# Altium schematic sheet Transmitter.SchDoc
size A4; SheetNumber: 1; SheetTotal: 2
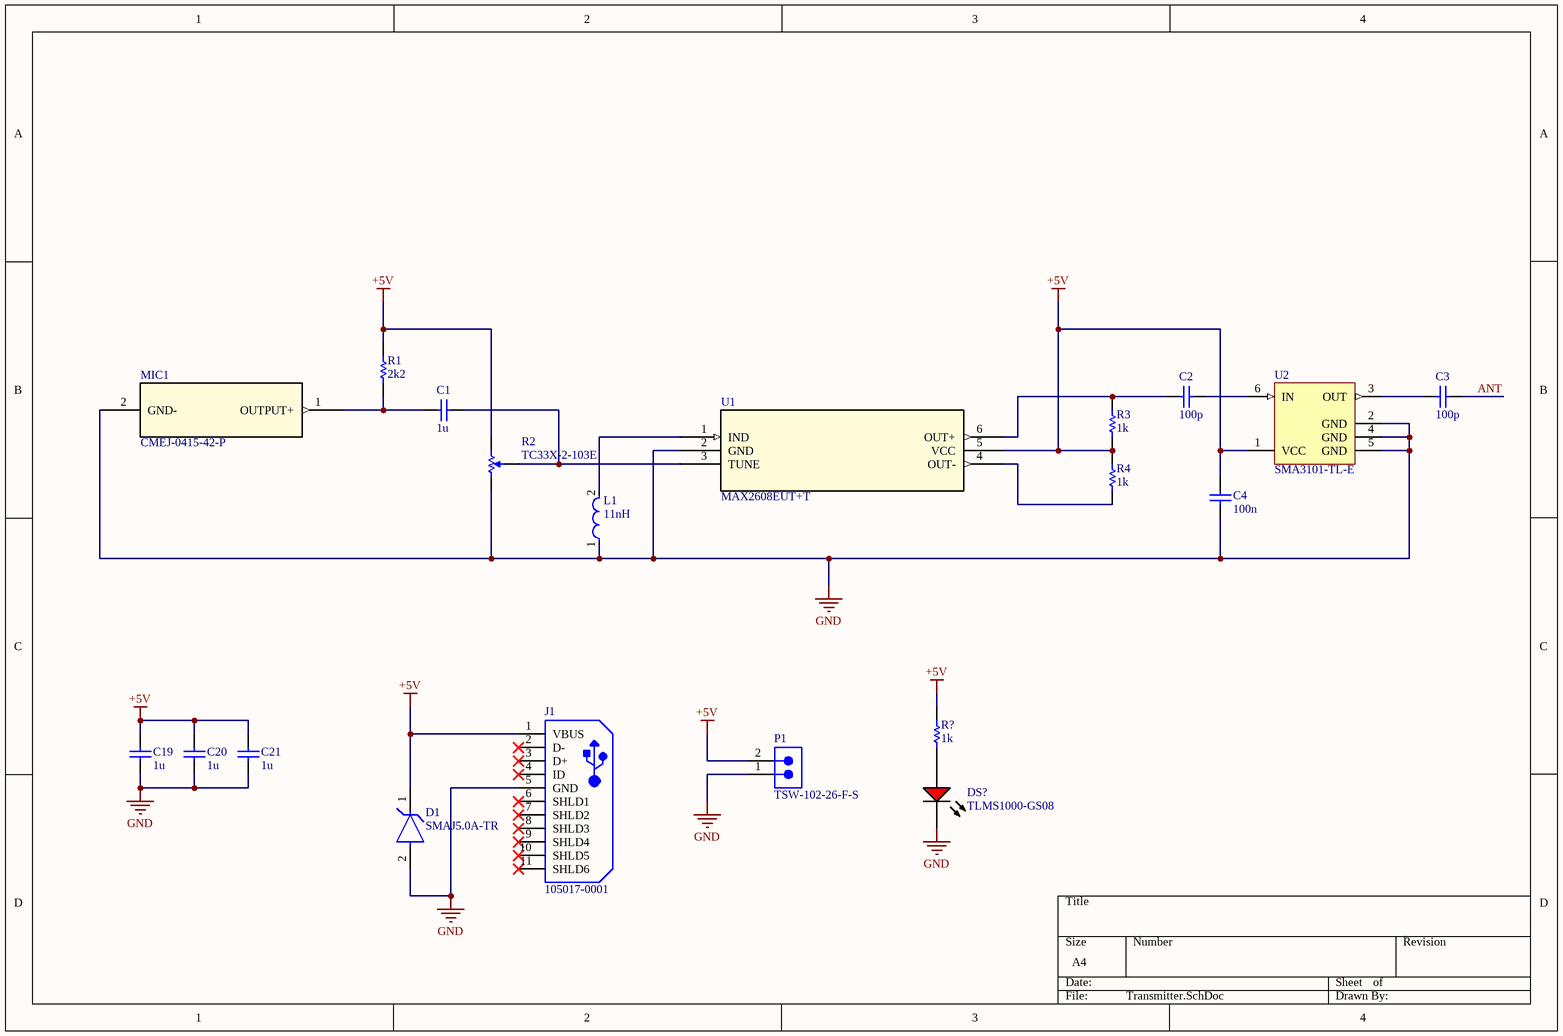
[diagram p0: Transmitter.SchDoc]

## Parts
C1  1u  [CAPC1608X90X35ML10T15]
C2  100p  [CAPC1608X90X35ML10T15]
C3  100p  [CAPC1608X90X35ML10T15]
C4  100n  [CAPC1608X90X35ML10T15]
C19  1u  [CAPC1608X90X35ML10T15]
C20  1u  [CAPC1608X90X35ML10T15]
C21  1u  [CAPC1608X90X35ML10T15]
D1  SMAJ5.0A-TR  [FP-SMA-MFG]
DS?  TLMS1000-GS08  [VISH-TLMS1000_V]
J1  105017-0001  [USB-MICRO-B_V]
L1  11nH  [FP-SRN2512-MFG]
MIC1  CMEJ-0415-42-P  [CMEJ-0415_CUD]
P1  TSW-102-26-F-S  [SMTC-TSW-102-26-XX-S]
R1  2k2  [RESC1608X55X25ML10T15]
R2  TC33X-2-103E  [BOUR-TC33X-2_V]
R3  1k  [RESC1608X55X25ML10T15]
R4  1k  [RESC1608X55X25ML10T15]
R?  1k  [RESC1608X55X25ML10T15]
U1  MAX2608EUT+T  [21-0058I_MXM]
U2  SMA3101-TL-E  [ONSC-MCPH-6_V]

## Nets
+5V: C4.2 C19.2 C20.2 C21.2 D1.1(K) J1.1(VBUS) P1.2 R1.2 R2.3 R3.1 R4.2 R?.1 U1.5(VCC) U2.1(VCC)
GND: C4.1 C19.1 C20.1 C21.1 D1.2(A) DS?.2(K) J1.5(GND) L1.1 MIC1.2(GND-) P1.1 R2.1 U1.2(GND) U2.2(GND) U2.4(GND) U2.5(GND)
ANT: C3.2
NetC1_1: C1.1 MIC1.1(OUTPUT+) R1.1
NetC1_2: C1.2 R2.2 U1.3(TUNE)
NetC2_1: C2.1 R3.2 U1.6(OUT+)
NetC2_2: C2.2 U2.6(IN)
NetC3_1: C3.1 U2.3(OUT)
NetDS?_1: DS?.1(A) R?.2
NetL1_2: L1.2 U1.1(IND)
NetR4_1: R4.1 U1.4(OUT-)

Not connected (* = marked no-connect by the designer): J1 2(D-)* 3(D+)* 4(ID)* 6(SHLD1)* 7(SHLD2)* 8(SHLD3)* 9(SHLD4)* 10(SHLD5)* 11(SHLD6)*

## Library data of the parts
C1-C4 C19-C21 = CMP-2100-03643-1: Chip Capacitor, 0.1 uF, +/- 10%, 50 V, -55 to 125 degC, 0603 (1608 Metric), RoHS, Tape and Reel; Manufacturer: Murata; Dielectric Material: Ceramic; Voltage Rating: 50V; Capacitance: 100nF; Dielectric: X7R; Insulation Resistance: 10GR; Case Code (Metric): 1608; Lead Free: LeadFree; Depth: 0.8mm; Number of Pins: 2; Radiation Hardening: No; Case/Package: 0603; Manufacturer URL: http://www.murata.com/; Packaging: TapeandReel; Length: 1.6mm; Contact Plating: Tin; Datasheet URL: http://psearch.en.murata.com/capacitor/product/GRM188R71H104KA93%23.pdf; Tolerance: 10%; Case Code (Imperial): 0603; Min Operating Temperature: -55degC; RoHSCompliant: true; Voltage: 50V; Termination: SMD/SMT; Mount: SurfaceMount; Material: Ceramic; Package Quantity: 1; Height: 0.8mm; Thickness: 0.035inch; REACH SVHC: NoSVHC; Max Operating Temperature: 125degC; Width: 0.8mm; Package Reference: 0603; Voltage Rating (DC): 50V; Datasheet Version: 42675.0; Package Description: 2-Pin Surface Mount Device, Body 1.6 x 0.8 mm
D1 = CMP-12225-000048-1: TVS DIODE 5V 13.4V SMA; Manufacturer: STMicroelectronics; Standoff Height: 0.05mm; Max Junction Temp: +150°C; Clamping Voltage: 9.2V; Number Of Channels: 1; Peak Pulse Power: 400W; Peak Pulse Current: 43.5A; Breakdown Voltage: 6.4V; Direction: Unidirectional; ComponentLink2Description: Datasheet; Lead Free: Yes; Package: SMA; Height: 2.65mm; Mouser Description: Transient Voltage Suppressor, TVS, Transil SMAJ Series, Unidirectional, 5 V, DO-214AC, 2, 6.4 V; Manufacturer Part Number: SMAJ5.0A-TR; Reverse Standoff Voltage: 5V; Temperature Range Low: -55°C; Device Class L1: Circuit Protection; RoHS: TRUE; Category: Diode; Automotive: No; ComponentLink2URL: https://www.st.com/resource/en/datasheet/smaj.pdf; Device Class L3: unset; Device Class L2: TVS Diodes; Temperature Range High: +150°C; Octopart: https://octopart.com/smaj5.0a-tr-stmicroelectronics-347063; Digikey Description: TVS DIODE 5V 13.4V SMA; Temperature: -55°C to +150°C
DS? = CMP-2000-07254-1: Low Current LED, 40 mW, 1.8 V, -40 to 100 degC, 2-Pin SMD (0603), RoHS, Tape and Reel; Manufacturer: Vishay; Lens Shape: Rectangular; Automotive Qualification Standard: AEC-Q100; Wavelength Typ: 636nm; SVHC: ToBeAdvised; LED Colour: Red; Bulb Size: 1.6mmx0.8mm; Forward Voltage: 1.8V; Luminous Intensity: 4mcd; Forward Current If: 2mA; Viewing Angle: 80°; Datasheet Version: Rev. 1.7, 02/2011; Datasheet URL: https://datasheet.ciiva.com/5798/1698881-5798337.pdf; LED Mounting: SMD; Packaging: CutTape; Package Reference: TLMS1000; Manufacturer URL: http://www.vishay.com/; Mounting Technology: SurfaceMount; Product Range: -; Package Description: 2-Pin Surface Mount Device, Body 1.6 x 0.8 mm; MSL: MSL2-1year
J1 = CMP-2000-05827-1: Micro-USB B Receptacle, Right Angle, Bottom Mount, Surface Mount, with Solder Tabs, -30 to 85 degC, 5-Pin USB, RoHS, Tape and Reel; Manufacturer: Molex; Featured Product: Micro-USBConnectorsUSBConnectors; Other Names: WM1399DKR; Package Version: Rev. F, 12/2012; Number of Contacts: 5; Connector Type: USB-microB; Catalog Drawings: 1050170001; 3D Model: 105017-0001.stp; Mating Products: WM17145-ND-CABLEMICROUSBBTOSTDA1.0MWM17147-ND-CABLEMICROUSBBTOSTDA2.0MWM17146-ND-CABLEMICROUSBBTOSTDA1.5M; PCN Assembly/Origin: ResinSupplier21/Oct/2015; Voltage - Max: 30V; Online Catalog: Molex-MicroUSB; Manufacturer URL: http://www.molex.com/; Package Description: 5-Leads USB, Micro B, Body 7.5 x 5 mm, Pitch 0.65 mm; Datasheet URL: http://www.molex.com/elqNow/elqRedir.htm?ref=http://www.molex.com/webdocs/datasheets/pdf/en-us/1050170001_IO_CONNECTORS.pdf; Ingress Protection: -; Datasheet Version: 03/2016; Mounting Type: BoardCutout,SurfaceMount,RightAngle; Circuits: 5; Standard Package: 1; Package Reference: MICRO-B; Package URL: http://www.molex.com/pdm_docs/sd/1050170001_sd.pdf; Category: Connectors,Interconnects; Series: -; RoHS Information: 1050170001CertofCompliance; Features: Shielded,SolderRetention; Family: USB,DVI,HDMIConnectors; Specifications: -; Gender: Receptacle; Packaging: Digi-Reel®; Mounting Technology: SurfaceMount
L1 = CMP-07248-000049-1: FIXED IND 240NH 4.7A 24 MOHM SMD; Inductance Tolerance: 20%; Core Material: Ferrite; Shielding: Shielded; Self Resonant Frequency: 330MHz; Test Frequency: 1MHz; DC Resistance (DCR): 24mR; Saturation Current: 8A; Package Quantity: 2000; Depth: 2mm; Case Code (Metric): 2520; Case Code (Imperial): 1008; Max DC Current: 4.7A; Width: 0.079inch; Weight: 0.001058oz; Current Rating: 4.7A; Tolerance: 20%; Mount: Surface Mount; Height - Seated (Max): 0.047inch; Min Operating Temperature: -55°C; Inductance: 240nH; RMS Current (Irms): 4.7A; REACH SVHC: No SVHC; Max Operating Temperature: 125°C; Length: 2.5mm; Packaging: Tape and Reel; Height: 1.2mm; Case/Package: 1008; Resistor Type: Wirewound; Termination: SMD/SMT; RoHS Compliant: Yes
MIC1 = CMEJ-0415-42-P: No Description Available; Mfr_Name: Same Sky; RefDes: RefDes; Type: Type
P1 = CMP-1024-00329-1: 0.025" SQ Post Header, Through-hole, Vertical, -55 to 125 degC, 2.54 mm Pitch, 2-Pin, Male, RoHS; Manufacturer: Samtec; Pitch: 2.54 mm; PackageVersion: DM, 8/1988; ComponentLink2Description: Datasheet; PackageReference: TSW-102-26-XX-S; ComponentLink3URL: http://www.samtec.com/documents/webfiles/cpdf/TSW-XXX-XX-XXX-X-XX-XXX-MKT.pdf; ComponentLink2URL: http://www.samtec.com/documents/webfiles/pdf/TSW_TH.PDF; ComponentLink1Description: Manufacturer URL; DatasheetVersion: F-214; RoHS: True; ComponentLink3Description: Package Specification; PartNumber: TSW-102-26-F-S; Temperature Range: -55 to 125 degC; Orientation: Vertical; ComponentLink1URL: http://www.samtec.com; PackageDescription: .025[0.64] SQ. Post Terminal Strip Assembly; Mounting Technology: Through-hole
R1 R3 R4 R? = CMP-2100-03667-1: Chip Resistor, 0 Ohm, +/- 5%, 0.1 W, -55 to 155 degC, 0603 (1608 Metric), RoHS, Tape and Reel; Manufacturer: Yageo; Temperature Coefficient: 200ppm/degreesC; Voltage Rating: 50V; Power Rating: 100mW; Resistance: 0mOhm; Width: 0.8mm; Max Operating Temperature: 155degC; Tolerance: 5%; Package Reference: 0603; Height: 0.45mm; Depth: 0.8mm; Package Description: 2-Pin Surface Mount Device, Body 1.6 x 0.8 mm; Termination: SMD/SMT; Package Quantity: 5000; Case/Package: 0603; Case Code (Imperial): 0603; Radiation Hardening: No; Number of Pins: 2; Length: 1.6mm; Lead Free: LeadFree; Voltage Rating (DC): 50V; Military Standard: Not; Datasheet URL: http://www.yageo.com/NewPortal/yageodocoutput?fileName=/pdf/R-Chip/PYu-RC_Group_51_RoHS_L_5.pdf; Manufacturer URL: http://www.yageo.com/; Packaging: TapeandReel; Case Code (Metric): 1608; Min Operating Temperature: -55degC; Composition: ThickFilm; RoHSCompliant: true; Contact Plating: Tin; Datasheet Version: Rev. 5, 10/2016; REACH SVHC: NoSVHC
R2 = CMP-2100-03695-1: Trimming Potentiometer, 10000 Ohm, -40 to 100 degC, 3-Pin SMD, RoHS, Tape and Reel; Manufacturer: Bourns; Tolerance: 25%; Max Power Dissipation: 100mW; Number of Turns: 1; Resistance: 10KOhm; Temperature Coefficient: 250ppm/degreesC; Voltage Rating (DC): 50V; Datasheet URL: http://www.bourns.com/docs/Product-Datasheets/TC33.pdf; Composition: Potentiometer; Package Description: 3-Pin Surface Mount Device, Body 3.8 x 3.6 mm; Weight: 29.4mg; Power Rating: 100mW; Termination: FootPrint; Manufacturer URL: http://www.bourns.com/; Width: 0.118inch; Height: 0.047inch; Military Standard: Not; Radiation Hardening: No; Colour: Silver; Case/Package: SMD/SMT; Depth: 3.8mm; Min Operating Temperature: -40degC; Lead Free: LeadFree; Datasheet Version: 42583.0; REACH SVHC: NoSVHC; Length: 3mm; RoHSCompliant: true; Contact Plating: Silver; Taper: Linear; Packaging: TapeandReel; Mount: SurfaceMount; Max Operating Temperature: 100degC; Package Reference: TC33X-2; Package Quantity: 2500
U1 = MAX2608EUT+T: No Description Available; Mfr_Name: Analog Devices / Maxim Integrated; RefDes: RefDes; Type: Type
U2 = CMP-1314-00002-1: MMIC, Amplifier, 5 V, 10 mA, 0.1 to 3 GHz, 4.5 to 5.5 V, -40 to 85 degC, 6-Pin MCPH, Pb-Free, Tape and Reel; Manufacturer: On Semiconductor; Power Gain Min (dB): 21.5; Upper Freq (3 dB) (GHz): 3; ICC Min (mA): 7.1; VCC Min (V): 4.5; Power Gain Max (dB): 28.5; ICC Max (mA): 12.6; VCC Max (V): 5.5; Noise Figure Max (dB): 5.3; ComponentLink3Description: Package Specification; ComponentLink3URL: http://www.onsemi.com/pub_link/Collateral/ENA1601-D.PDF; PackageDescription: 6-Pin Small Outline Transistor, Body 2 x 1.6 mm, Pitch 0.65 mm; PartNumber: SMA3101-TL-E; ComponentLink2Description: Datasheet; ComponentLink2URL: http://www.onsemi.com/pub_link/Collateral/ENA1431A-D.PDF; RoHS: TRUE; Packing: Tape and Reel; ComponentLink1URL: http://www.onsemi.com/; Mounting Technology: Surface Mount; ComponentLink1Description: Manufacturer URL; PackageReference: MCPH-6; DatasheetVersion: Rev. 1